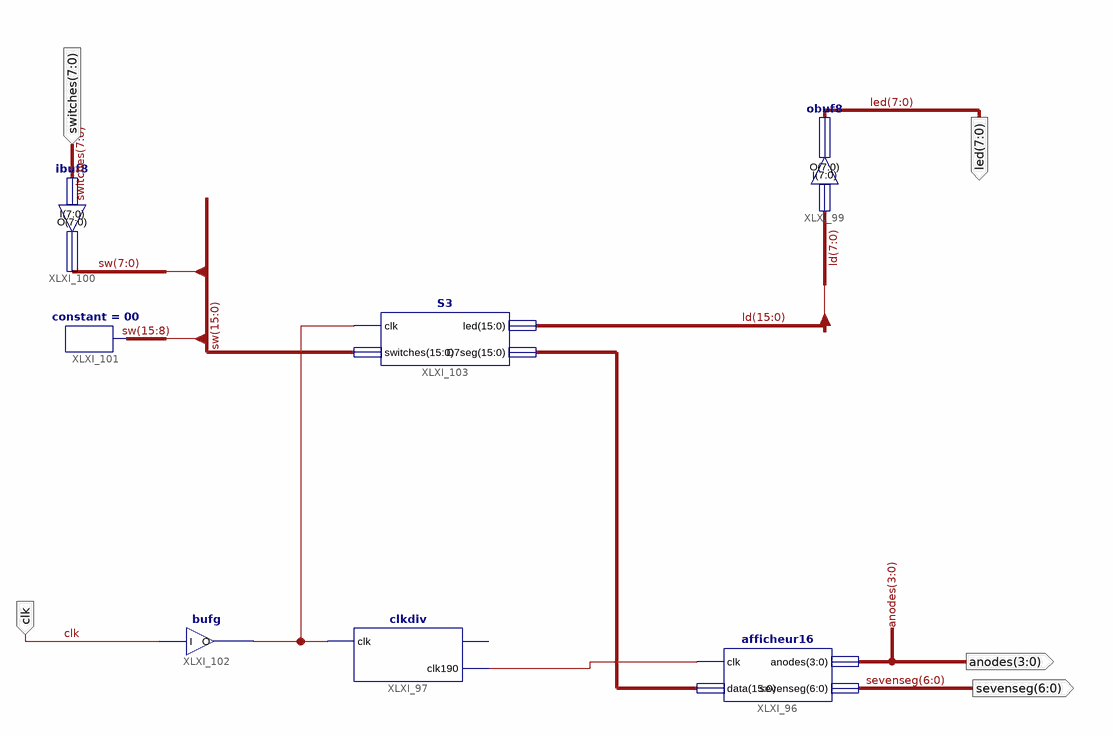
[diagram p0: schematic sheet 1]
// Xilinx ISE schematic toplevel.sch (spartan3e) as structural Verilog: 7 symbols, 5 ports
module toplevel (
  input  [7:0] switches,
  input  clk,
  output [3:0] anodes,
  output [6:0] sevenseg,
  output [7:0] led
);

  wire XLXN_134, XLXN_145;
  wire [15:0] ld, sw, XLXN_135;

  afficheur16 XLXI_96 (.clk(XLXN_134), .data(XLXN_135), .anodes(anodes), .sevenseg(sevenseg));
  clkdiv XLXI_97 (.clk(XLXN_145), .clk190(XLXN_134));  // open: clksec
  obuf8 XLXI_99 (.I(ld[7:0]), .O(led));
  ibuf8 XLXI_100 (.I(switches), .O(sw[7:0]));
  constant #(.CValue("00")) XLXI_101 (.O(sw[15:8]));
  bufg XLXI_102 (.I(clk), .O(XLXN_145));
  S3 XLXI_103 (.clk(XLXN_145), .switches(sw), .led(ld), .D7seg(XLXN_135));
endmodule
